# Altium schematic sheet BYPASS_BLOCK.SchDoc
size A4; SheetNumber: 6; SheetTotal: 15
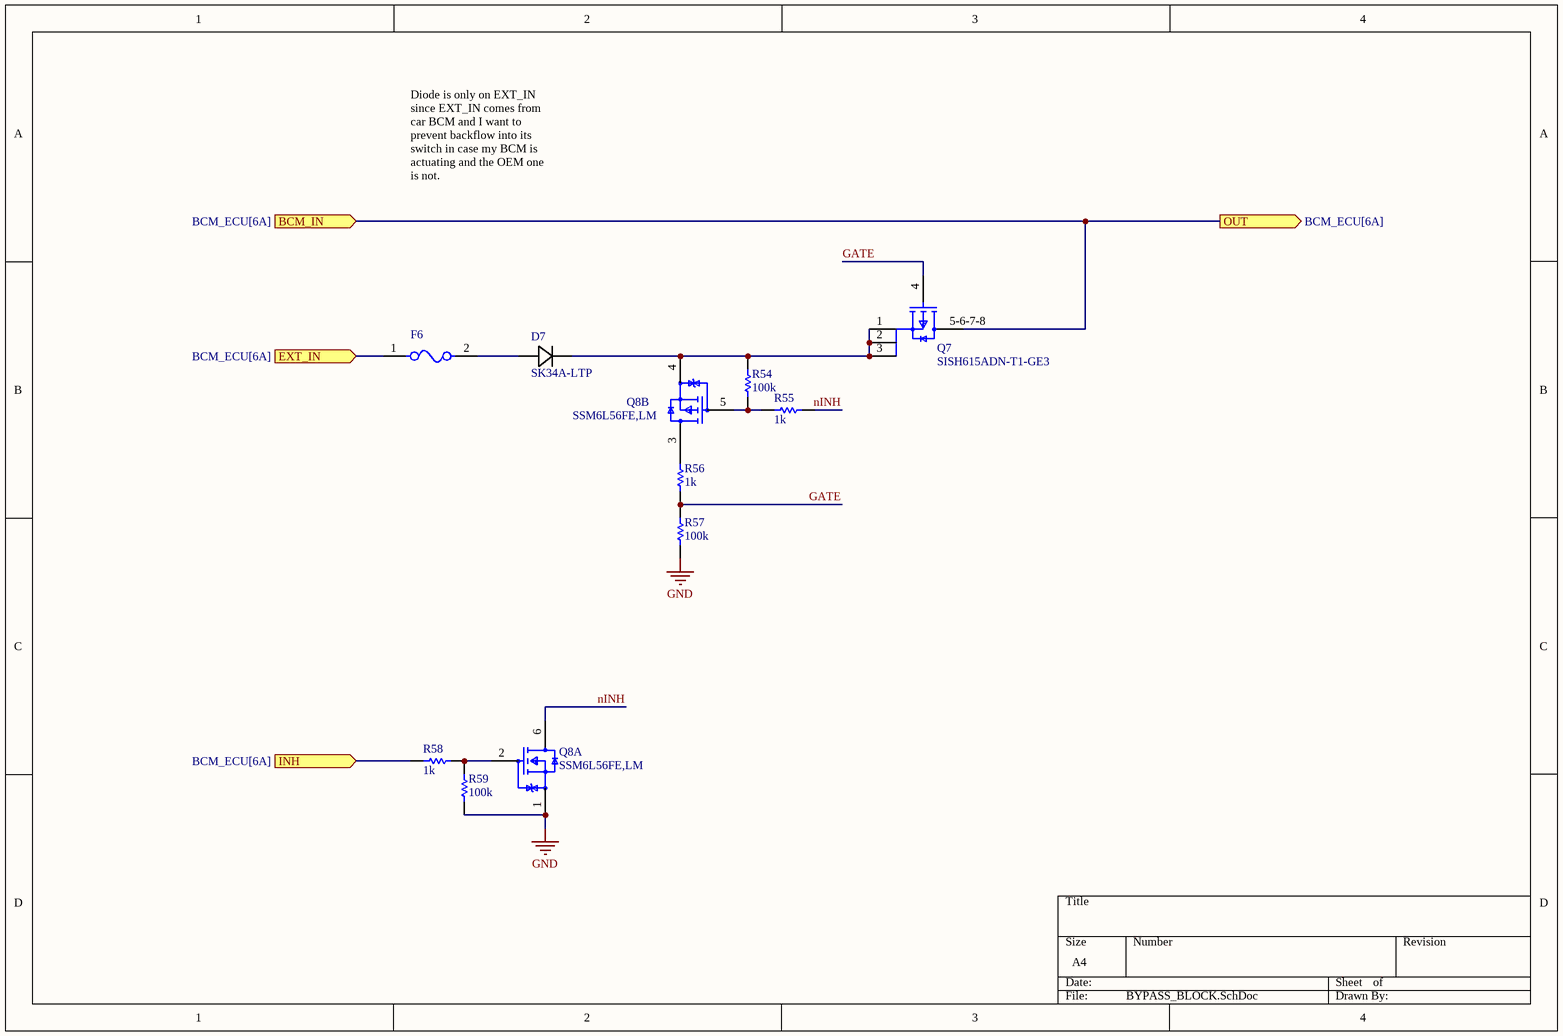
[diagram p0: BYPASS_BLOCK.SchDoc]

## Parts
D7  SK34A-LTP  [SK34A-LTP-Footprint-1]
F6  0466003.NR  [FP-0466-MFG]  (value not drawn)
Q7  SISH615ADN-T1-GE3  [SISH615ADN-T1-GE3-Footprint-1]
Q8  SSM6L56FE,LM  [FP-SON6-P-0_50-MFG]  (parts A,B of 2)
R54  100k  [R0603B]
R55  1k  [R0603B]
R56  1k  [R0603B]
R57  100k  [R0603B]
R58  1k  [R0603B]
R59  100k  [R0603B]

## Ports
BCM_IN (in, see BCM_ECU[6A]), EXT_IN (in, see BCM_ECU[6A]), INH (in, see BCM_ECU[6A]), OUT (out, see BCM_ECU[6A])

## Nets
GND: Q8.1(Source_1) R57.2 R59.1
BCM_IN: Q7.5-6-7-8(D) ; port OUT, port BCM_IN
EXT_IN: F6.1 ; port EXT_IN
GATE: Q7.4(G) R56.2 R57.1
INH: R58.2 ; port INH
nINH: Q8.6(Drain_1) R55.2
NetD7_1: D7.1(CATHODE) Q7.1(S) Q7.2(S) Q7.3(S) Q8.4(Source_2) R54.1
NetD7_2: D7.2(ANODE) F6.2
NetQ8_2: Q8.2(Gate_1) R58.1 R59.2
NetQ8_3: Q8.3(Drain_2) R56.1
NetQ8_5: Q8.5(Gate_2) R54.2 R55.1

## Notes on the sheet
- Diode is only on EXT_IN since EXT_IN comes from car BCM and I want to prevent backflow into its switch in case my BCM is actuating and the OEM one is not.

## Library data of the parts
D7 = CMP-004-00058-2: Rectifier Diode, Schottky, 1 Phase, 1 Element, 3A, 40V V(RRM), Silicon, DO-214AC; Forward Voltage: 500mV; Max Operating Temperature: 125°C; Pins: 2; RoHS Compliant: Yes
F6 = CMP-08605-000054-1: FUSE BOARD MNT 3A 32VAC/VDC 1206; Manufacturer: Littelfuse; Fuse Interrupt Ac Current: 50A; Fuse Voltage Drop: 75.99mV; Max Fuse Ac Voltage: 32V; Fuse I2T: 0.576A2Sec; Resistance: 0.019Ω; Fuse Blow Speed: Fast; Value: 0.019Ω; ComponentLink2Description: Datasheet; Fuse Current: 3A; RoHS: TRUE; Mouser Description: Surface Mount Fuses 32V 3A VFA Slimline; Height: 0.66mm; Octopart: https://octopart.com/0466003.nr-littelfuse-565175; Package: 0466; Fuse Interrupt Dc Current: 50A; Manufacturer Part Number: 0466003.NR; Temperature Range Low: -55°C; ComponentLink2URL: https://www.littelfuse.com/~/media/electronics/datasheets/fuses/littelfuse_fuse_466_datasheet.pdf.pdf; Digikey Description: FUSE BOARD MNT 3A 32VAC/VDC 1206; Voltage Rating: 32V; Category: Fuse; Lead Free: Yes; Device Class L2: Fuses; Automotive: No; Max Fuse Dc Voltage: 32V; Temperature Range High: +90°C; Device Class L3: unset; Device Class L1: Circuit Protection; Temperature: -55°C to +90°C
Q7 = CMP-013-00018-2: Trans MOSFET P-CH 20V 22.1A 8-Pin PowerPAK 1212 EP T/R; Source: SISH615ADN-T1-GE3.SchLib; Design Item ID: CMP-013-00036-4; Component Type: Standard; Pins: 5
Q8 = CMP-35916-000023-1: SMALL-SIGNAL MOSFET 2 IN 1 NCH +
R54-R59 = CMP-009-00002-14: Resistor
  R54 R57 R59: Value: 100k
  R55 R56 R58: Value: 1k